# Altium schematic sheet pcb_benelli.SchDoc
size A
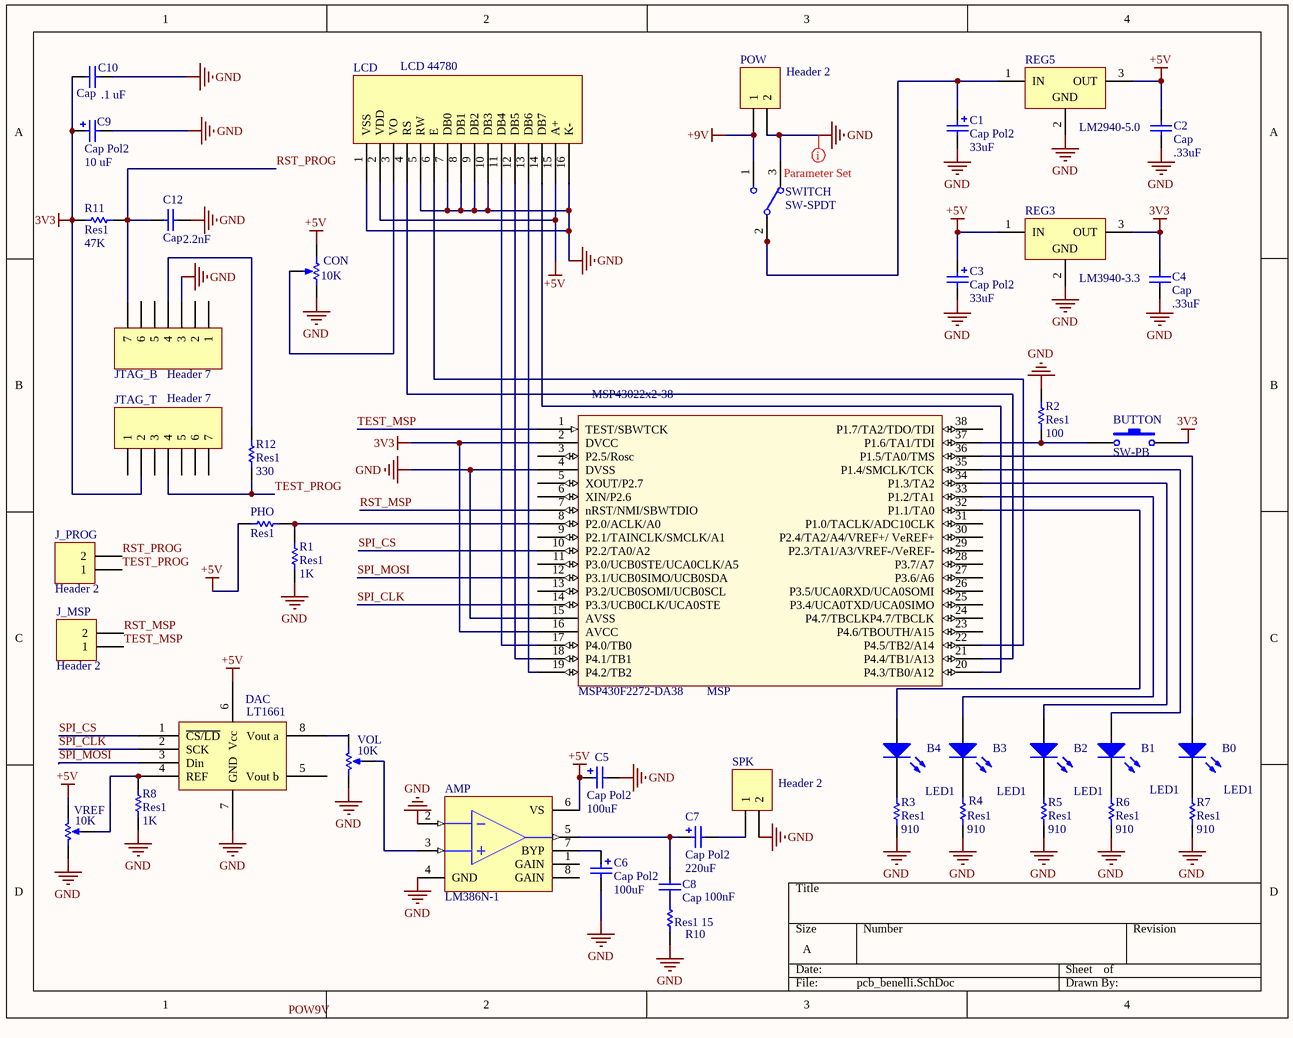
[diagram p0: pcb_benelli.SchDoc]

## Parts
AMP  LM386N-1  [DIP-8]
B0  LED1  [DIODE-0.4]
B1  LED1  [DIODE-0.4]
B2  LED1  [DIODE-0.4]
B3  LED1  [DIODE-0.4]
B4  LED1  [DIODE-0.4]
BUTTON  SW-PB  [SW PB]
C1  Cap Pol2  value 33uF  [CAPR5-4X5]
C2  Cap  value .33uF  [RAD-0.3]
C3  Cap Pol2  value 33uF  [CAPR5-4X5]
C4  Cap  value .33uF  [RAD-0.3]
C5  Cap Pol2  value 100uF  [CAPR5-4X5]
C6  Cap Pol2  value 100uF  [CAPR5-4X5]
C7  Cap Pol2  value 220uF  [CAPR5-4X5]
C8  Cap  value 100nF  [RAD-0.3]
C9  Cap Pol2  value 10 uF  [CAPR5-4X5]
C10  Cap  value .1 uF  [RAD-0.3]
C12  Cap  value 2.2nF  [RAD-0.3]
CON  value 10K  [VR5]  (hidden comment: RPot_3)
DAC  LT1661  [DIP-8]
J_MSP  Header 2  [HDR1X2]
J_PROG  Header 2  [HDR1X2]
JTAG_B  Header 7  [HDR1X7]
JTAG_T  Header 7  [HDR1X7]
LCD  LCD 44780  [OLED 16x2]
MSP  MSP430F2272-DA38  [DIP38]
PHO  Res1  [AXIAL-0.3]
POW  Header 2  [HDR1X2]
R1  Res1  value 1K  [AXIAL-0.3]
R2  Res1  value 100  [AXIAL-0.3]
R3  Res1  value 910  [AXIAL-0.3]
R4  Res1  value 910  [AXIAL-0.3]
R5  Res1  value 910  [AXIAL-0.3]
R6  Res1  value 910  [AXIAL-0.3]
R7  Res1  value 910  [AXIAL-0.3]
R8  Res1  value 1K  [AXIAL-0.3]
R10  Res1  value 15  [AXIAL-0.3]
R11  Res1  value 47K  [AXIAL-0.3]
R12  Res1  value 330  [AXIAL-0.3]
REG3  LM3940-3.3  [T03B]
REG5  LM2940-5.0  [T03B]
SPK  Header 2  [HDR1X2]
SWITCH  SW-SPDT  [SW DPST jameco]
VOL  value 10K  [VR5]  (hidden comment: RPot_3)
VREF  value 10K  [VR5]  (hidden comment: RPot_3)

## Nets
3V3: BUTTON.2 C4.2 C9.1 C10.1 JTAG_T.2 MSP.2(DVCC) MSP.16(AVCC) R11.1 REG3.3(OUT)
+5V: AMP.6(VS) C2.2 C3.1 C5.1 CON.1(TOP) DAC.6(Vcc) LCD.2(VDD) LCD.15(A+) PHO.1 REG3.1(IN) REG5.3(OUT) VREF.1(TOP)
+9V: POW.1 SWITCH.1
GND: AMP.2(IN-) AMP.4(GND) C1.2 C2.1 C3.2 C4.1 C5.2 C6.2 C9.2 C10.2 C12.2 CON.3(BOT) DAC.7(GND) JTAG_B.3 LCD.1(VSS) LCD.5(RW) LCD.7(DB0) LCD.8(DB1) LCD.9(DB2) LCD.10(DB3) LCD.16(K-) MSP.4(DVSS) MSP.15(AVSS) POW.2 R1.1 R2.2 R3.2 R4.2 R5.2 R6.2 R7.2 R8.1 R10.1 REG3.2(GND) REG5.2(GND) SPK.2 SWITCH.3 VOL.3(BOT) VREF.3(BOT)
RST_MSP: J_MSP.2 MSP.7(nRST/NMI/SBWTDIO)
RST_PROG: C12.1 J_PROG.2 JTAG_B.7 R11.2
SPI_CLK: DAC.2(SCK) MSP.14(P3.3/UCB0CLK/UCA0STE)
SPI_CS: DAC.1(~{CS/LD}) MSP.10(P2.2/TA0/A2)
SPI_MOSI: DAC.3(Din) MSP.12(P3.1/UCB0SIMO/UCB0SDA)
TEST_MSP: J_MSP.1 MSP.1(TEST/SBWTCK)
TEST_PROG: J_PROG.1 JTAG_T.4 R12.1
NetAMP_3: AMP.3(IN+) VOL.2(TAP)
NetAMP_5: AMP.5(OUT) C7.1 C8.2
NetAMP_7: AMP.7(BYP) C6.1
NetB0_1: B0.1(A) MSP.36(P1.5/TA0/TMS)
NetB0_2: B0.2(K) R7.1
NetB1_1: B1.1(A) MSP.35(P1.4/SMCLK/TCK)
NetB1_2: B1.2(K) R6.1
NetB2_1: B2.1(A) MSP.34(P1.3/TA2)
NetB2_2: B2.2(K) R5.1
NetB3_1: B3.1(A) MSP.33(P1.2/TA1)
NetB3_2: B3.2(K) R4.1
NetB4_1: B4.1(A) MSP.32(P1.1/TA0)
NetB4_2: B4.2(K) R3.1
NetBUTTON_1: BUTTON.1 MSP.37(P1.6/TA1/TDI) R2.1
NetC1_1: C1.1 REG5.1(IN) SWITCH.2
NetC7_2: C7.2 SPK.1
NetC8_1: C8.1 R10.2
NetCON_2: CON.2(TAP) LCD.3(VO)
NetDAC_4: DAC.4(REF) R8.2 VREF.2(TAP)
NetDAC_8: DAC.8(Vout_a) VOL.1(TOP)
NetJTAG_B_4: JTAG_B.4 R12.2
NetLCD_4: LCD.4(RS) MSP.21(P4.4/TB1/A13)
NetLCD_6: LCD.6(E) MSP.22(P4.5/TB2/A14)
NetLCD_11: LCD.11(DB4) MSP.17(P4.0/TB0)
NetLCD_12: LCD.12(DB5) MSP.18(P4.1/TB1)
NetLCD_13: LCD.13(DB6) MSP.19(P4.2/TB2)
NetLCD_14: LCD.14(DB7) MSP.20(P4.3/TB0/A12)
NetMSP_8: MSP.8(P2.0/ACLK/A0) PHO.2 R1.2

Not connected (* = marked no-connect by the designer): AMP 1(GAIN) 8(GAIN); DAC 5(Vout_b); JTAG_B 1 2 5 6; JTAG_T 1 3 5 6 7; MSP 3(P2.5/Rosc) 5(XOUT/P2.7) 6(XIN/P2.6) 9(P2.1/TAINCLK/SMCLK/A1) 11(P3.0/UCB0STE/UCA0CLK/A5) 13(P3.2/UCB0SOMI/UCB0SCL) 23(P4.6/TBOUTH/A15) 24(P4.7/TBCLKP4.7/TBCLK) 25(P3.4/UCA0TXD/UCA0SIMO) 26(P3.5/UCA0RXD/UCA0SOMI) 27(P3.6/A6) 28(P3.7/A7) 29(P2.3/TA1/A3/VREF-/VeREF-) 30(P2.4/TA2/A4/VREF+/_VeREF+) 31(P1.0/TACLK/ADC10CLK) 38(P1.7/TA2/TDO/TDI)

## Layout directives
rule Width Constraint [Pref Width = 30mil    Min Width = 30mil    Max Width = 30mil]: GND

## Notes on the sheet
- Labels drawn without touching a wire or pin: POW9V
- (in symbol MSP430F22x2-DA38) MSP43022x2-38

## Library data of the parts
AMP = LM386N-1: Low-Voltage Audio Power Amplifier; Published: 15-Apr-2002; DatasheetDocument: Sep-1997; PackageDocument: Sep-1997; PackageReference: N08E; Publisher: Altium Limited
B0-B4 = LED1: Typical RED GaAs LED; Published: 8-Jun-2000; LatestRevisionDate: 08-Jul-2005; LatestRevisionNote: Mech Layer 1 removed.; PackageReference: LED-1; Publisher: Altium Limited; PackageDescription: LED; 2 Leads
BUTTON = SW-PB: DIGIKEY SW400-ND; Published: 24-Mar-1999; LatestRevisionDate: 17-Jul-2002; LatestRevisionNote: Re-released for DXP Platform.; Publisher: Altium Limited
C1 C3 C5-C7 C9 = Cap Pol2: Polarized Capacitor (Axial); Published: 8-Jun-2000; LatestRevisionDate: 17-Jul-2002; LatestRevisionNote: Re-released for DXP Platform.; PackageReference: POLAR0.8; Publisher: Altium Limited; PackageDescription: Polarized Capacitor; 2 Leads
C2 C4 C8 C10 C12 = Cap: Capacitor; Published: 8-Jun-2000; LatestRevisionDate: 17-Jul-2002; LatestRevisionNote: Re-released for DXP Platform.; PackageReference: RAD-0.3; Publisher: Altium Limited; PackageDescription: Radial Cap, Thru-Hole; 2 Leads; 0.3 in Pin Spacing
CON VOL VREF = RPot: Potentiometer; Sim Note: Enter the Resistance value and the set point into parameter fields.; Set Position: 0.5; Published: 8-Jun-2000; LatestRevisionDate: 17-Jul-2002; LatestRevisionNote: Re-released for DXP Platform.; Publisher: Altium Limited
J_MSP J_PROG POW SPK = Header 2: Header, 2-Pin; LatestRevisionDate: 17-Jul-2002; LatestRevisionNote: Re-released for DXP Platform.; Publisher: Altium Limited
JTAG_B JTAG_T = Header 7: Header, 7-Pin; LatestRevisionDate: 17-Jul-2002; LatestRevisionNote: Re-released for DXP Platform.; Publisher: Altium Limited
MSP = MSP430F22x2-DA38: Supplier 1: Digi-Key; Supplier Part Number 1: 296-21456-1-ND
PHO R1-R8 R10-R12 = Res1: Resistor; Published: 8-Jun-2000; LatestRevisionDate: 17-Jul-2002; LatestRevisionNote: Re-released for DXP Platform.; PackageReference: AXIAL-0.3; Publisher: Altium Limited; PackageDescription: Axial Device, Thru-Hole; 2 Leads; 0.3 in Pin Spacing
REG3 REG5 = LM2940CT-5.0: 1A Low Dropout Regulator, 3-pin TO-220; PartNumber: LM2940CT-3.3; Manufacturer: National Semiconductor; PackageTopMarking: NSUZXYTTE#*LM2940CT*-5.0 P+; PowerWise: N; CompType: LDO IC; High-Reliability: Y; DatasheetVersion: Jan-2007; PackageVersion: revL, Jan-1992; PackageReference: T03B; PackageDescription: TO-220, Molded, 3 Lead, Straight; RoHS: N; PinCount: 3; ComponentLink1Description: Manufacturer URL; ComponentLink1URL: http://www.national.com/; ComponentLink2Description: LM2940C Datasheet; ComponentLink2URL: http://www.national.com/ds/LM/LM2940C.pdf; ComponentLink3Description: LM2940C Web Page; ComponentLink3URL: http://www.national.com/pf/LM/LM2940C.html; ComponentLink4Description: T03B Package Page; ComponentLink4URL: http://www.national.com/packaging/folders/t03b.html
SWITCH = SW-SPDT: SPDT Subminiature Toggle Switch, Right Angle Mounting, Vertical Actuation; Published: 24-Mar-1999; LatestRevisionDate: 17-Dec-2003; LatestRevisionNote: Schematic revised, PCB Footprint replaced.; DatasheetVersion: 05-Dec-2000; PackageReference: TL36WW15050; Publisher: Altium Limited; PackageDescription: Switch; 4 Leads; ComponentLink1Description: Manufacturer Link; ComponentLink1URL: http://www.apem.com